# Altium schematic sheet ir.SchDoc
size A3
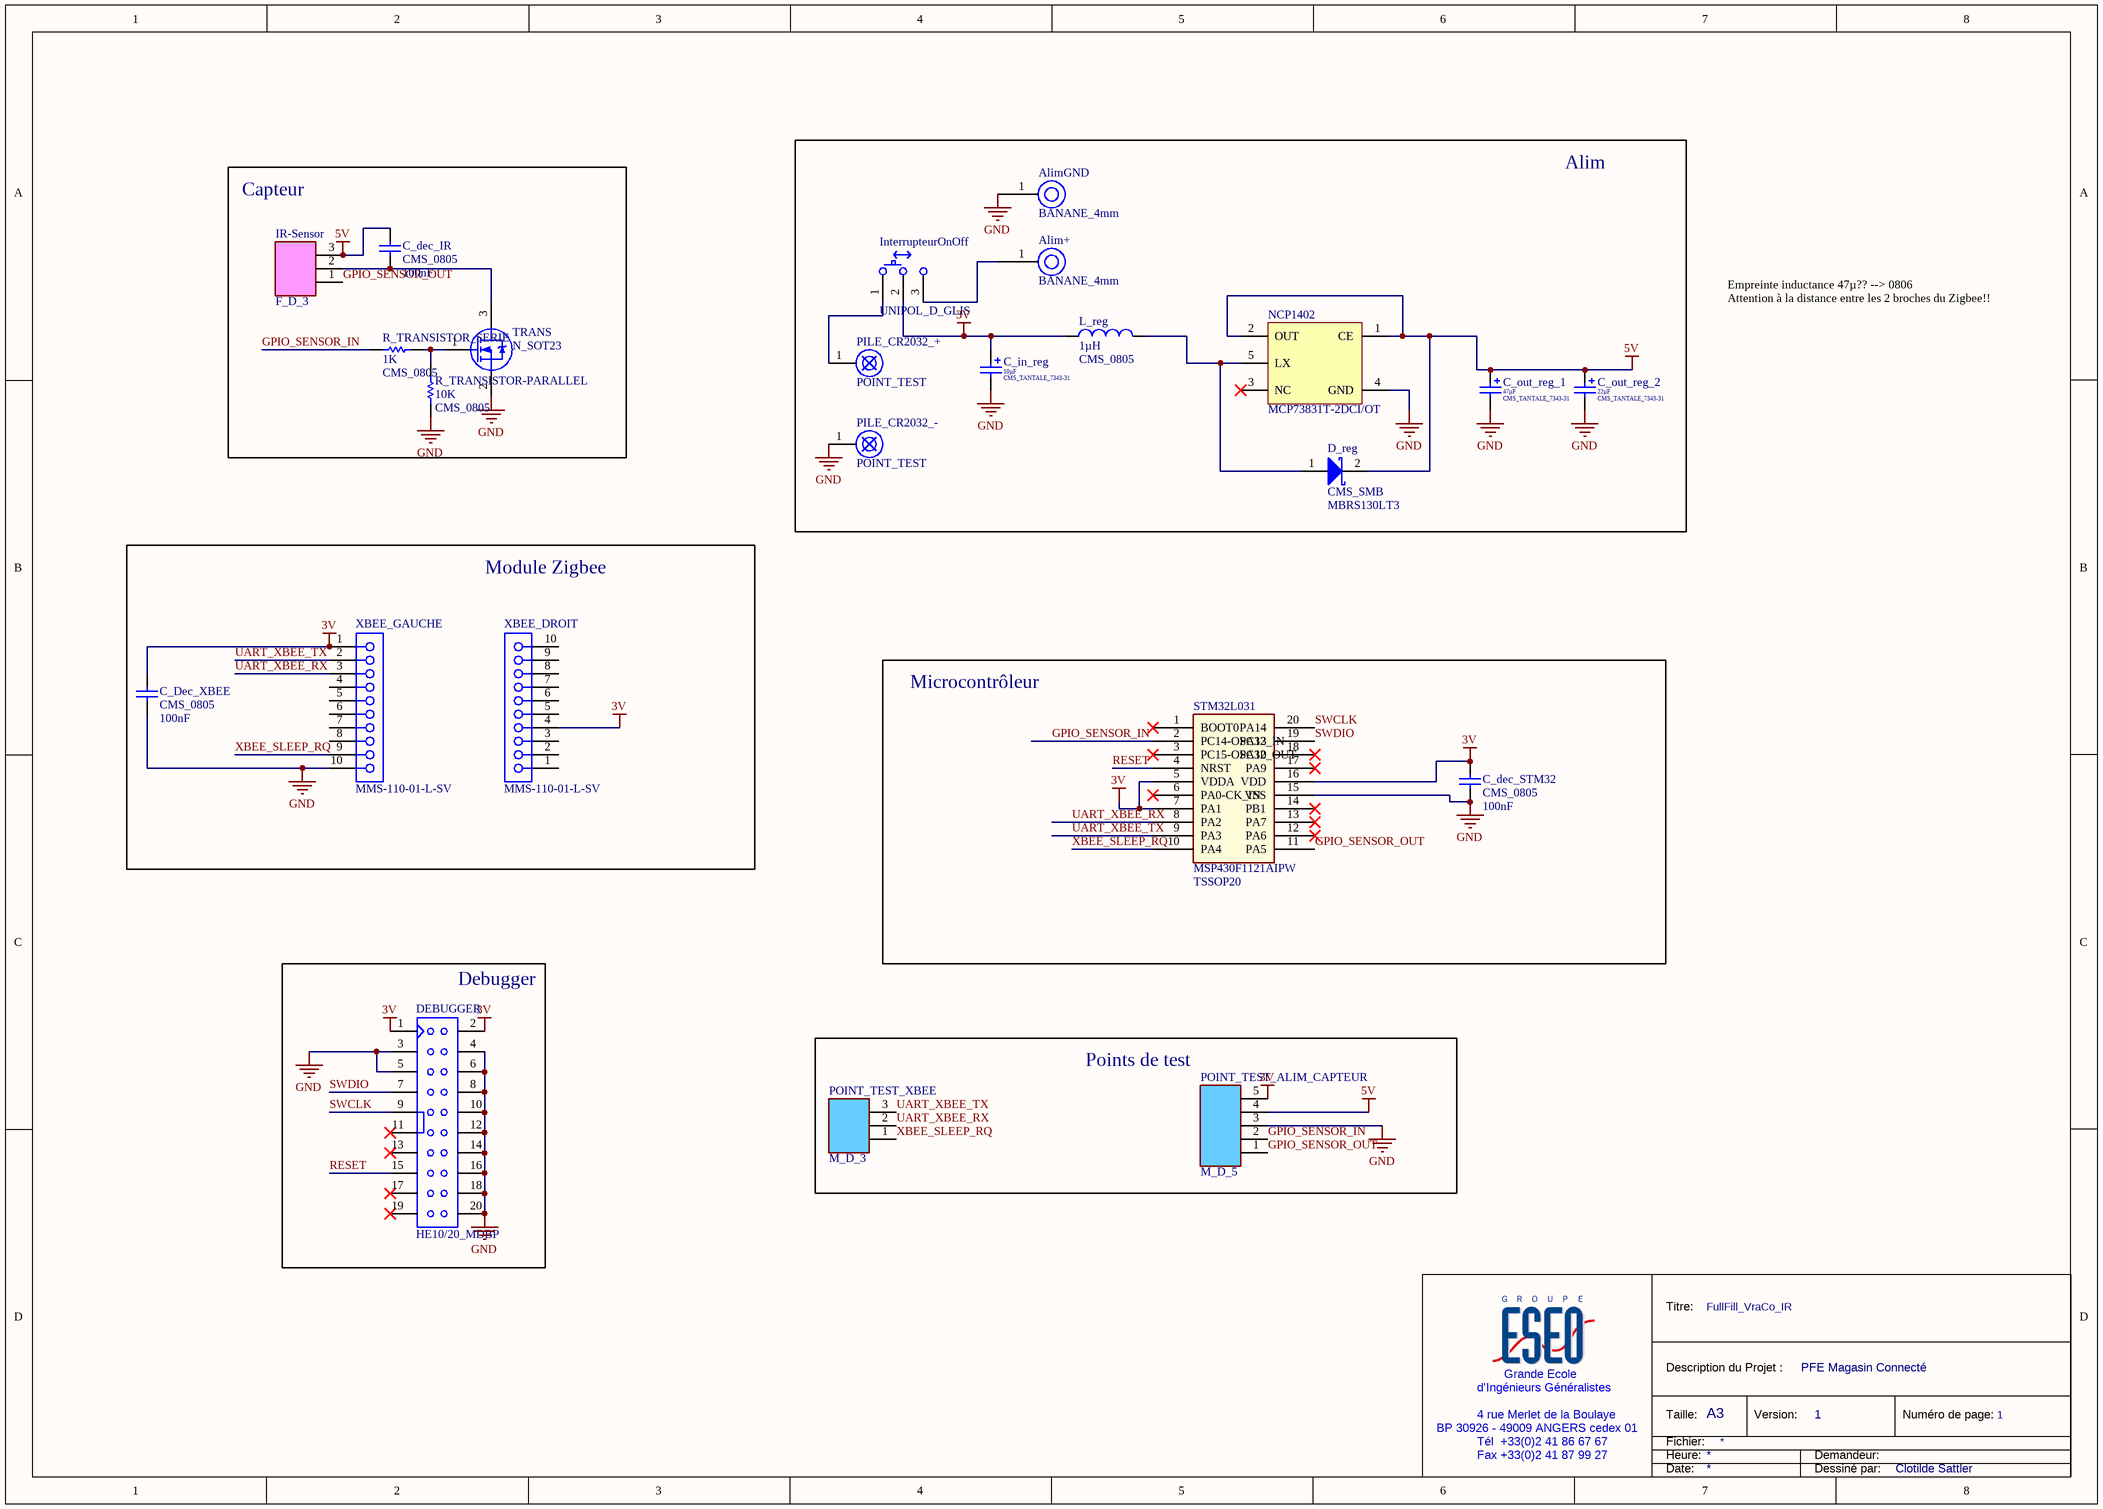
[diagram p0: ir.SchDoc]

## Parts
Alim+  Type: BANANE_4mm  [DOUILLE_BANANE_4mm]  (hidden comment: DOUILLE BANANE 4mm)
AlimGND  Type: BANANE_4mm  [DOUILLE_BANANE_4mm]  (hidden comment: DOUILLE BANANE 4mm)
C_dec_IR  value 100nF  [CONDENSATEUR_CMS_0805]  (hidden comment: CMS_0805)
C_dec_STM32  value 100nF  [CONDENSATEUR_CMS_0805]  (hidden comment: CMS_0805)
C_Dec_XBEE  value 100nF  [CONDENSATEUR_CMS_0805]  (hidden comment: CMS_0805)
C_in_reg  value 10µF  Type: CMS_TANTALE_7343-31  [CONDENSATEUR_CMS_POLARISE_TANTALE_D/7343-31]  (hidden comment: CMS_POLARISE_TANTALE_7343-31)
C_out_reg_1  value 47µF  Type: CMS_TANTALE_7343-31  [CONDENSATEUR_CMS_POLARISE_TANTALE_D/7343-31]  (hidden comment: CMS_POLARISE_TANTALE_7343-31)
C_out_reg_2  value 22µF  Type: CMS_TANTALE_7343-31  [CONDENSATEUR_CMS_POLARISE_TANTALE_D/7343-31]  (hidden comment: CMS_POLARISE_TANTALE_7343-31)
D_reg  Package: CMS_SMB  Type: MBRS130LT3  [DIODE_CMS_SMB]  (hidden comment: DIODE_CMS_SCHOTTKY_SMB : MBRS130LT3)
DEBUGGER  Type: HE10/20_MDBP  [HE10/20_M_D_BP]  (hidden comment: HE10/20_MALE_DROIT_BAS_PROFIL)
InterrupteurOnOff  Type: UNIPOL_D_GLIS  [INTER_UNIPOL_DROIT_GLISS]  (hidden comment: INTERRUPTEUR_UNIPOLAIRE_DROIT_GLISSIERE)
IR-Sensor  Type: F_D_3  [BARRETTE_3_F_D]  (hidden comment: BARRETTE 3 CONTACTS 1 RANGEE FEMELLE DROITE)
L_reg  value 1µH  Type: CMS_0805  [INDUCTANCE_CMS_0805]  (hidden comment: INDUCTANCE_CMS_0805)
NCP1402  MCP73831T-2DCI/OT  [SOT-23-OT5_N]
PILE_CR2032_+  POINT_TEST  [POINT_TEST]
PILE_CR2032_-  POINT_TEST  [POINT_TEST]
POINT_TEST_ALIM_CAPTEUR  Type: M_D_5  [BARRETTE_5_M_D]  (hidden comment: BARRETTE_5 CONTACTS_1 RANGEE_MALE_DROITE)
POINT_TEST_XBEE  Type: M_D_3  [BARRETTE_3_M_D]  (hidden comment: BARRETTE 3 CONTACTS 1 RANGEE MALE DROITE)
R_TRANSISTOR-PARALLEL  value 10K  Type: CMS_0805  [RESISTANCE_CMS_0805]  (hidden comment: RESISTANCE_CMS_0805)
R_TRANSISTOR_SERIE  value 1K  Type: CMS_0805  [RESISTANCE_CMS_0805]  (hidden comment: RESISTANCE_CMS_0805)
STM32L031  Type: MSP430F1121AIPW  Package: TSSOP20  [TSSOP20_PAS=0.65_LARG=6.4_LONG=6.5]  (hidden comment: MSP430F1121AIPW_TSSOP20)
TRANS  Package: N_SOT23  [TRANSISTOR_MOSFET-N_SOT23_GSD]  (hidden comment: TRANSISTOR_MOSFET-N_SOT23_GSD)
XBEE_DROIT  MMS-110-01-L-SV  [SMTC-MMS-110-01-X-SV]
XBEE_GAUCHE  MMS-110-01-L-SV  [SMTC-MMS-110-01-X-SV]

## Blocks framed on the sheet
Capteur: C_dec_IR IR-Sensor R_TRANSISTOR-PARALLEL R_TRANSISTOR_SERIE TRANS
Alim: Alim+ AlimGND C_in_reg C_out_reg_1 C_out_reg_2 D_reg InterrupteurOnOff L_reg NCP1402 PILE_CR2032_+ PILE_CR2032_-
Module Zigbee: C_Dec_XBEE XBEE_DROIT XBEE_GAUCHE
Microcontrôleur: C_dec_STM32 STM32L031
Debugger: DEBUGGER
Points de test: POINT_TEST_ALIM_CAPTEUR POINT_TEST_XBEE

## Nets
3V: C_dec_STM32.2 C_Dec_XBEE.2 C_in_reg.1 DEBUGGER.1 DEBUGGER.2 InterrupteurOnOff.2 L_reg.1 POINT_TEST_ALIM_CAPTEUR.5 STM32L031.5(VDDA) STM32L031.7(PA1) STM32L031.16(VDD) XBEE_DROIT.4 XBEE_GAUCHE.1
5V: C_dec_IR.2 C_out_reg_1.1 C_out_reg_2.1 D_reg.2 IR-Sensor.3(OUT) NCP1402.1(CE) NCP1402.2(OUT) POINT_TEST_ALIM_CAPTEUR.4
GND: AlimGND.1 C_dec_STM32.1 C_Dec_XBEE.1 C_in_reg.2 C_out_reg_1.2 C_out_reg_2.2 DEBUGGER.3 DEBUGGER.4 DEBUGGER.5 DEBUGGER.6 DEBUGGER.8 DEBUGGER.10 DEBUGGER.12 DEBUGGER.14 DEBUGGER.16 DEBUGGER.18 DEBUGGER.20 NCP1402.4(GND) PILE_CR2032_-.1 POINT_TEST_ALIM_CAPTEUR.3 R_TRANSISTOR-PARALLEL.1 STM32L031.15(VSS) TRANS.2(S) XBEE_GAUCHE.10
GPIO_SENSOR_IN: POINT_TEST_ALIM_CAPTEUR.2 R_TRANSISTOR_SERIE.1 STM32L031.2(PC14-OSC32_IN)
GPIO_SENSOR_OUT: IR-Sensor.1(GND) POINT_TEST_ALIM_CAPTEUR.1 STM32L031.11(PA5)
RESET: DEBUGGER.15 STM32L031.4(NRST)
SWCLK: DEBUGGER.9 STM32L031.20(PA14)
SWDIO: DEBUGGER.7 STM32L031.19(PA13)
UART_XBEE_RX: POINT_TEST_XBEE.2 STM32L031.8(PA2) XBEE_GAUCHE.3
UART_XBEE_TX: POINT_TEST_XBEE.3 STM32L031.9(PA3) XBEE_GAUCHE.2
XBEE_SLEEP_RQ: POINT_TEST_XBEE.1 STM32L031.10(PA4) XBEE_GAUCHE.9
NetAlim+_1: Alim+.1 InterrupteurOnOff.3
NetC_dec_IR_1: C_dec_IR.1 IR-Sensor.2(VCC) TRANS.3(D)
NetD_reg_1: D_reg.1 L_reg.2 NCP1402.5(LX)
NetInterrupteurOnOff_1: InterrupteurOnOff.1 PILE_CR2032_+.1
NetR_TRANSISTOR-PARALLEL_2: R_TRANSISTOR-PARALLEL.2 R_TRANSISTOR_SERIE.2 TRANS.1(G)

Not connected (* = marked no-connect by the designer): DEBUGGER 11* 13* 17* 19*; NCP1402 3(NC)*; STM32L031 1(BOOT0)* 3(PC15-OSC32_OUT)* 6(PA0-CK_IN)* 12(PA6)* 13(PA7)* 14(PB1)* 17(PA9)* 18(PA10)*; XBEE_DROIT 1(11) 2(12) 3(13) 5(15) 6(16) 7(17) 8(18) 9(19) 10(20); XBEE_GAUCHE 4 5 6 7 8

## Notes on the sheet
- Empreinte inductance 47µ?? --> 0806
  Attention à la distance entre les 2 broches du Zigbee!!
- Titre:
- FullFill_VraCo_IR
- d'Ingénieurs Généralistes
- Grande Ecole
- Description du Projet :
- PFE Magasin Connecté
- BP 30926 - 49009 ANGERS cedex 01
- 4 rue Merlet de la Boulaye
- Tél  +33(0)2 41 86 67 67
- Fax +33(0)2 41 87 99 27
- Taille:
- Heure:
- Fichier:
- A3
- Version:
- 1
- Demandeur:
- Numéro de page:
- Date:
- Dessiné par:
- Clotilde Sattler

## Library data of the parts
Alim+ AlimGND = DOUILLE_BANANE_4mm: DOUILLE BANANE 4 mm
C_dec_IR C_dec_STM32 C_Dec_XBEE = CONDENSATEUR_CMS_CER_0805: CONDENSATEUR CMS CERAMIQUE 0805; Type: CMS_0805
C_in_reg C_out_reg_1 C_out_reg_2 = CONDENSATEUR_CMS_POL_TANT_D_7343-31: CONDENSATEUR CMS POLARISE TANTALE BOITIER D/7343-31
D_reg = DIODE_CMS_SCHOTTKY_SMB : MBRS130LT3: DIODE CMS SCHOTTKY SMB : MBRS130LT3
DEBUGGER = HE10/20_MALE_DROIT_BAS_PROFIL: EMBASE HE10/20 MALE DROIT BAS PROFIL
InterrupteurOnOff = INTERRUPTEUR_UNIPOLAIRE_DROIT_GLISSIERE: INTERRUPTEUR UNIPOLAIRE DROIT A GLISSIERE
IR-Sensor = BARRETTE_3 CONTACTS_1 RANGEE_FEMELLE_DROITE
L_reg = INDUCTANCE_CMS_0805: INDUCTANCE CMS 0805
NCP1402 = MCP73831T-2DCI/OT: Miniature Single-Cell, Fully Integrated Li-Ion, Li-Polymer Charge Management Controller, 4.2V, 5-Pin SOT-23, Industrial Temperature, Tape and Reel; Manufacturer: Microchip; DatasheetVersion: revE, Sep-2008; PackageVersion: revBB, Aug-2009; PackageReference: SOT-23-OT5; PackageDescription: 5-Lead Plastic Small Outline Transistor (OT) [SOT-23]; Supplier 1: Digi-Key; Supplier Part Number 1: MCP73831T-2DCI/OTTR-ND; Supplier 2: Digi-Key; Supplier Part Number 2: MCP73831T-2DCI/OTCT-ND; Supplier 3: Digi-Key; Supplier Part Number 3: MCP73831T-2DCI/OTDKR-ND; Supplier 4: Farnell; Supplier Part Number 4: 1840935; Supplier 5: Newark; Supplier Part Number 5: 84R6271; Supplier 6: Mouser; Supplier Part Number 6: 579-MCP73831T-2DCIOT; Mounting Technology: Surface Mount; Code_IPC: SOT23-5; PartNumber: MCP73831T-2DCI/OT; ComponentLink1Description: Manufacturer URL; ComponentLink1URL: http://www.microchip.com/; ComponentLink2Description: Datasheet; ComponentLink2URL: http://ww1.microchip.com/downloads/en/DeviceDoc/21984e.pdf; ComponentLink3Description: Package Specification; ComponentLink3URL: http://www.microchip.com/stellent/groups/techpub_sg/documents/packagingspec/en012702.pdf
PILE_CR2032_+ PILE_CR2032_- = POINT_TEST: POINT TEST
POINT_TEST_ALIM_CAPTEUR = BARRETTE_5 CONTACTS_1 RANGEE_MALE_DROITE: BARRETTE 5 CONTACTS 1 RANGEE MALE DROITE
POINT_TEST_XBEE = BARRETTE_3 CONTACTS_1 RANGEE_MALE_DROITE
R_TRANSISTOR-PARALLEL R_TRANSISTOR_SERIE = RESISTANCE_CMS_0805: RESISTANCE CMS 0805
STM32L031 = MSP430F1121AIPW_TSSOP20: MICROCONTROLEUR FLASH - 16BITS - TSSOP20
TRANS = TRANSISTOR_MOSFET-N_SOT23_GSD: TRANSISTOR MOSFET CANAL N BOITIER SOT23_GSD
XBEE_DROIT XBEE_GAUCHE = MMS-110-01-L-SV: Tiger Claw(TM) Socket Strip, Through-hole, Vertical, -55 to 125 degC, 2 mm Pitch, 10-Pin, Female, RoHS; Manufacturer: Samtec; Pitch: 2 mm; DatasheetVersion: F-214; PackageVersion: AO, 2/1993; PackageReference: MMS-110-01-X-SV; PackageDescription: 2mm Through Hole Box Connector Strip Assembly; Supplier 1: Digi-Key; Supplier Part Number 1: SAM1230-10-ND; Supplier 2: Farnell; Supplier Part Number 2: 1885919; Supplier 3: Newark; Supplier Part Number 3: 41T0710; Supplier 4: Newark; Supplier Part Number 4: 96M0485; Orientation: Vertical; RoHS: True; Temperature Range: -55 to 125 degC; Mounting Technology: Through-hole; PartNumber: MMS-110-01-L-SV; ComponentLink1Description: Manufacturer URL; ComponentLink1URL: http://www.samtec.com; ComponentLink2Description: Datasheet; ComponentLink2URL: http://www.samtec.com/documents/webfiles/pdf/MMS.PDF; ComponentLink3Description: Package Specification; ComponentLink3URL: http://www.samtec.com/documents/webfiles/cpdf/MMS-1XX-01-XXX-XX-XXX-MKT1.pdf